# EAGLE design Carro_BT_V2 (EAGLE 9.6.2)
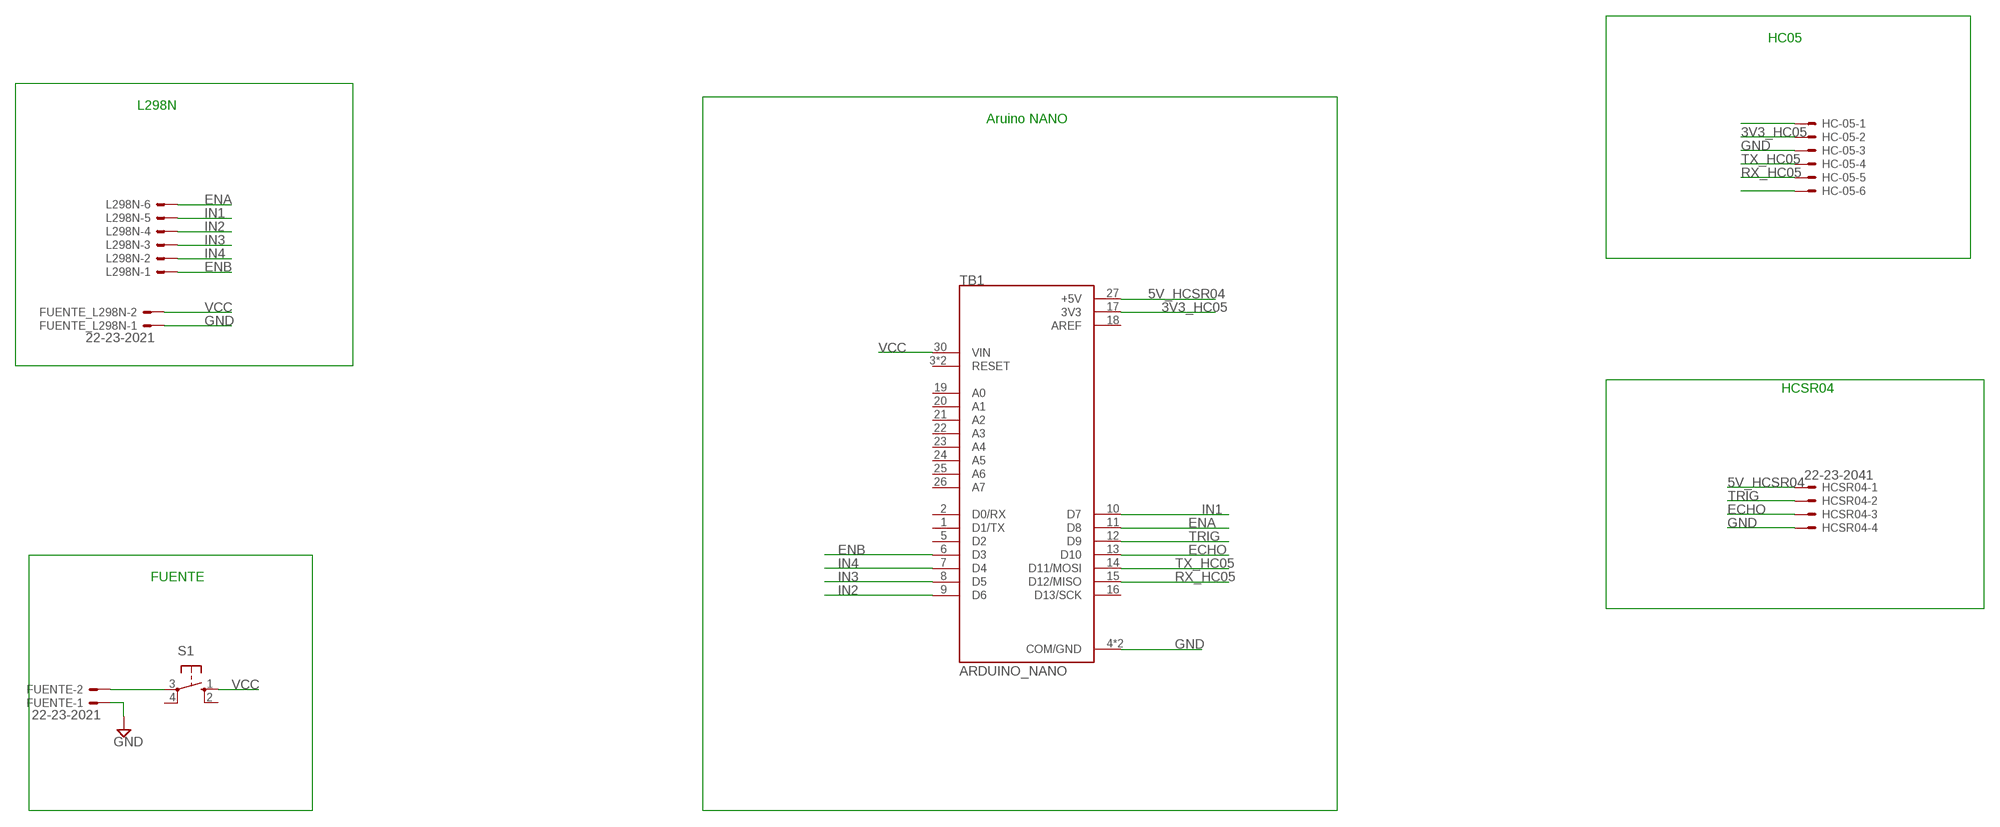
[diagram p0: schematic, sheet 1]

## Parts
FUENTE  22-23-2021  [22-23-2021]
FUENTE_L298N  22-23-2021  [22-23-2021]
HC-05  22-23-2061  [22-23-2061]
HCSR04  22-23-2041  [22-23-2041]
L298N  22-23-2061  [22-23-2061]
S1  10-XX  [B3F-10XX]
TB1  ARDUINO_NANO  [SHIELD_ARDUINO_NANO]

## Nets
3V3_HC05: HC-05.2 TB1.17(3V3)
5V_HCSR04: HCSR04.1 TB1.27(+5V)
ECHO: HCSR04.3 TB1.13(D10)
ENA: L298N.6 TB1.11(D8)
ENA1: HC-05.6
ENB: L298N.1 TB1.6(D3)
ENB1: HC-05.1
GND: FUENTE.1 FUENTE_L298N.1 HC-05.3 HCSR04.4 TB1.4(COM/GND) TB1.29(COM/GND)
IN1: L298N.5 TB1.10(D7)
IN2: L298N.4 TB1.9(D6)
IN3: L298N.3 TB1.8(D5)
IN4: L298N.2 TB1.7(D4)
N$6: FUENTE.2 S1.3(P)
RX_HC05: HC-05.5 TB1.15(D12/MISO)
TRIG: HCSR04.2 TB1.12(D9)
TX_HC05: HC-05.4 TB1.14(D11/MOSI)
VCC: FUENTE_L298N.2 S1.1(S) TB1.30(VIN)
Unconnected: S1.2(S1) S1.4(P1) TB1.1(D1/TX) TB1.2(D0/RX) TB1.3(RESET) TB1.5(D2) TB1.16(D13/SCK) TB1.19(A0) TB1.20(A1) TB1.21(A2) TB1.22(A3) TB1.23(A4) TB1.24(A5) TB1.25(A6) TB1.26(A7) TB1.28(RESET)

## Notes on the sheet
- HC05
- L298N
- Aruino NANO
- HCSR04
- FUENTE

## Power pins joined to a net without a drawn wire
AREF: TB1.18(AREF)

## Library data of the parts
FUENTE FUENTE_L298N = con-molex:22-23-2021: .100" (2.54mm) Center Header - 2 Pin; MF: MOLEX; MPN: 22-23-2021; OC_FARNELL: 1462926; OC_NEWARK: 25C3832
HC-05 L298N = con-molex:22-23-2061: .100" (2.54mm) Center Header - 6 Pin; MF: MOLEX; MPN: 22-23-2061; OC_FARNELL: 1462922; OC_NEWARK: 27C1933
HCSR04 = con-molex:22-23-2041: .100" (2.54mm) Center Header - 4 Pin; MF: MOLEX; MPN: 22-23-2041; OC_FARNELL: 1462920; OC_NEWARK: 38C0355
S1 = switch-omron:10-XX: OMRON SWITCH; MPN: B3F-1000; OC_FARNELL: 176432; OC_NEWARK: 36M3542
TB1 = ARDUINO_NANO:ARDUINO_NANO: Arduino Nano, Through Hole; AVAILABILITY: Unavailable; DESCRIPTION: ATmega4809 Arduino Nano Every with Headers AVR® AVR MCU 8-Bit Embedded Evaluation Board; MF: Arduino; MP: ARDUINO NANO; PACKAGE: None; PRICE: None

## Board
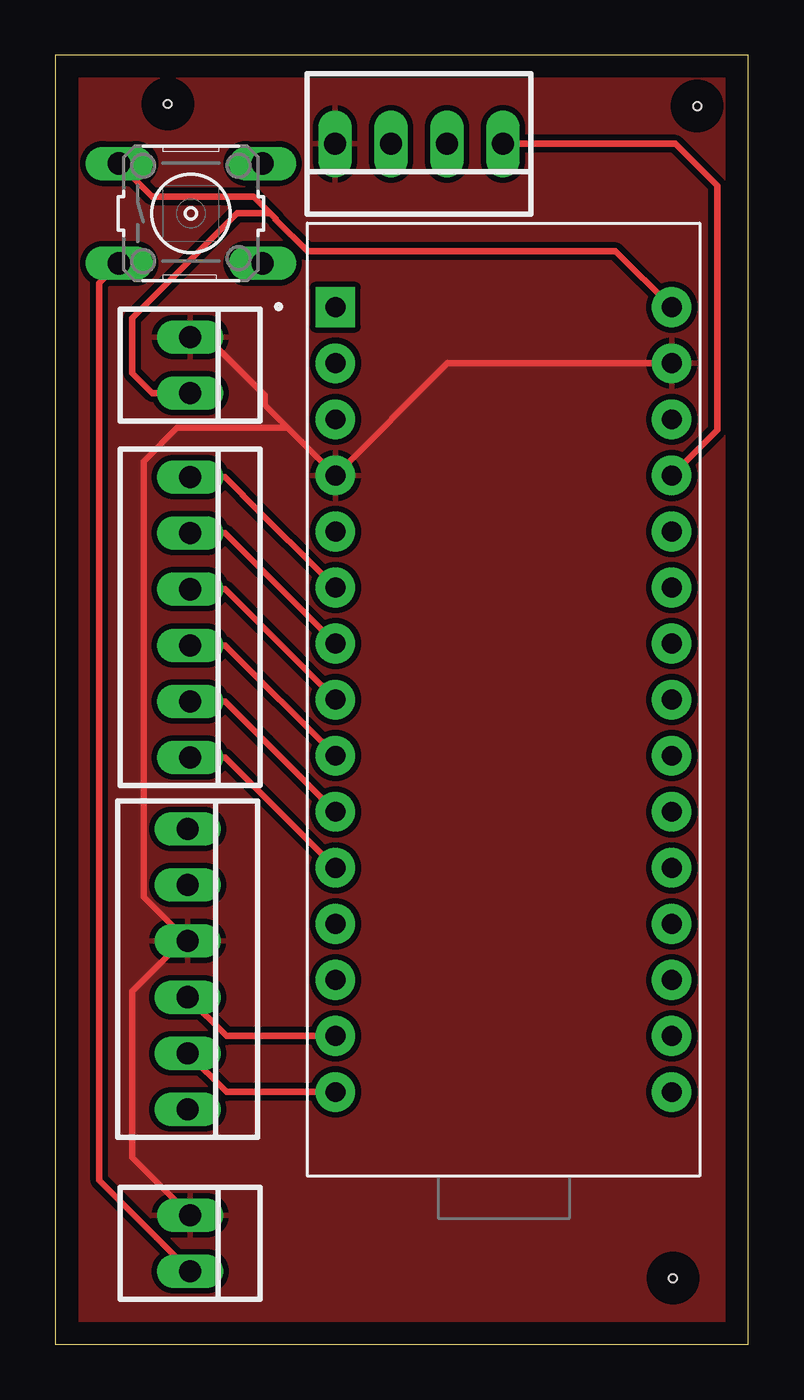
[diagram p1: board, top side]
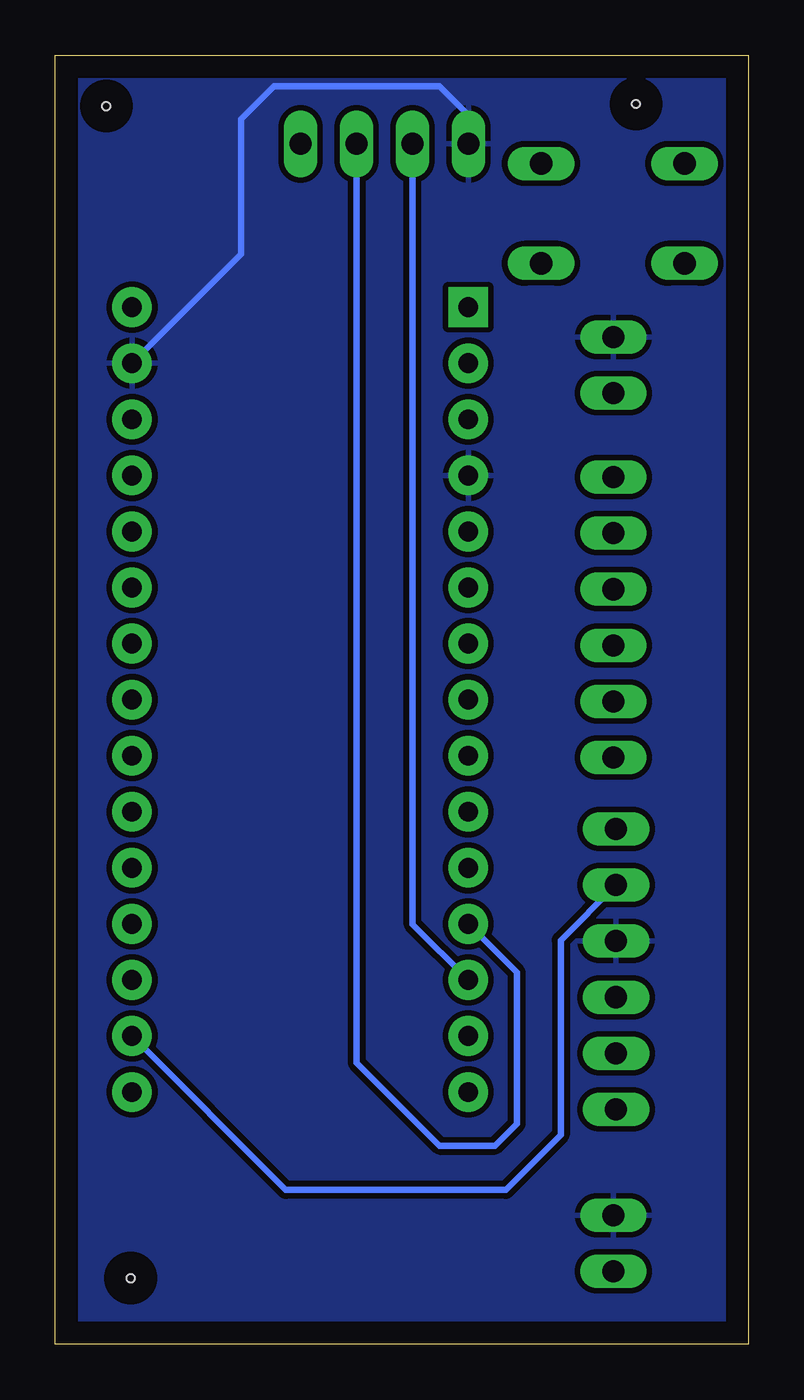
[diagram p2: board, bottom side, seen from below]

Size 31.42 x 58.41 mm. Coordinates in mm from the lower left corner, seen from the top.
Outline: 0,0 31.42,0 31.42,58.41 0,58.41 0,0
Copper layers (1*16): Top 0.035mm / dielectric 1.5mm / Bottom 0.035mm
Design rules "default *": minimum track width 0.2mm, minimum drill 0.35mm, track to track 10mil, track to pad 10mil, pad to pad 10mil, via to via 10mil, smd to smd 6mil, copper to edge 40mil, drill to drill 10mil, minimum pad ring 10mil, minimum via ring 8mil, stop-mask expansion 4mil, vias tented up to drill 0mil, thermal gap 10mil
Holes 0.35 mm at 28,3 5.1,56.2 29.1,56.1

### Footprints (pad centres in the part's own frame; a part is rotated, then mirrored left to right if it is on the bottom)
22-23-2021 = drill 1 long: 1 -1.27,0; 2 1.27,0
22-23-2061 = drill 1 long: 1 -6.35,0; 2 -3.81,0; 3 -1.27,0; 4 1.27,0; 5 3.81,0; 6 6.35,0
22-23-2041 = drill 1 long: 1 -3.81,0; 2 -1.27,0; 3 1.27,0; 4 3.81,0
B3F-10XX = drill 1.016 long: 1 -3.251,2.261; 2 3.251,2.261; 3 -3.251,-2.261; 4 3.251,-2.261
SHIELD_ARDUINO_NANO = drill 0.9 pad 1.8 square: 1 -7.62,17.78 | drill 0.9 pad 1.8: 2 -7.62,15.24; 3 -7.62,12.7; 4 -7.62,10.16; 5 -7.62,7.62; 6 -7.62,5.08; 7 -7.62,2.54; 8 -7.62,0; 9 -7.62,-2.54; 10 -7.62,-5.08; 11 -7.62,-7.62; 12 -7.62,-10.16; 13 -7.62,-12.7; 14 -7.62,-15.24; 15 -7.62,-17.78; 16 7.62,-17.78; 17 7.62,-15.24; 18 7.62,-12.7; 19 7.62,-10.16; 20 7.62,-7.62; 21 7.62,-5.08; 22 7.62,-2.54; 23 7.62,0; 24 7.62,2.54; 25 7.62,5.08; 26 7.62,7.62; 27 7.62,10.16; 28 7.62,12.7; 29 7.62,15.24; 30 7.62,17.78

### Placement (x,y rotation side)
FUENTE  6.12,4.58 270 top
FUENTE_L298N  6.12,44.37 270 top
HC-05  6,17 270 top
HCSR04  16.49,54.39 180 top
L298N  6.12,32.94 270 top
S1  6.15,51.24 0 top
TB1  20.32,29.21 0 top

### Tracks (layer width: path | path; a pad name or v marks a point on that pad's centre or on a via)
3V3_HC05
  Bottom 0.305: HC-05.2 8.5,18.31 8.5,9.5 11,7 20.97,7 TB1.17
5V_HCSR04
  Top 0.305: TB1.27 30,41.43 30,52.5 28.11,54.39 HCSR04.1
ECHO
  Bottom 0.305: TB1.13 15.22,19.03 HCSR04.3
ENA
  Top 0.305: TB1.11 7.7,26.59 L298N.6
ENB
  Top 0.305: TB1.6 8.5,38.49 8.5,38.5 7.71,39.29 L298N.1
GND
  Top 0.305: TB1.29 17.78,44.45 TB1.4 10.54,41.53 | 10.54,41.53 9.5,42.57 9.5,43 6.86,45.64 FUENTE_L298N.1 | FUENTE.1 3.5,8.47 3.5,16 5.77,18.27 HC-05.3 4,20.27 4,40 5.54,41.53 10.54,41.53
  Bottom 0.305: TB1.29 23,49.39 23,55.5 21.5,57 14,57 12.68,55.68 HCSR04.4
  pour Bottom: 0.5,58 0.5,0.5 31,0.5 31,58
  pour Top: 0.5,58 0.5,0.5 31,0.5 31,58
IN1
  Top 0.305: TB1.10 7.7,29.13 L298N.5
IN2
  Top 0.305: TB1.9 7.7,31.67 L298N.4
IN3
  Top 0.305: TB1.8 7.7,34.21 L298N.3
IN4
  Top 0.305: TB1.7 7.7,36.75 L298N.2
N$6
  Top 0.305: FUENTE.2 2,7.43 2,48.08 S1.3
RX_HC05
  Top 0.305: TB1.15 7.76,11.43 HC-05.5
TRIG
  Bottom 0.305: HCSR04.2 17.76,12.76 14,9 11.5,9 10.5,10 10.5,16.85 TB1.12
TX_HC05
  Top 0.305: TB1.14 7.76,13.97 HC-05.4
VCC
  Top 0.305: TB1.30 25.4,49.53 11.43,49.53 10,50.96 10,51 9.75,51.25 | 9.75,51.25 9,52 4.4,52 S1.1 | FUENTE_L298N.2 4.4,43.1 3.5,44 3.5,46.5 8.25,51.25 9.75,51.25